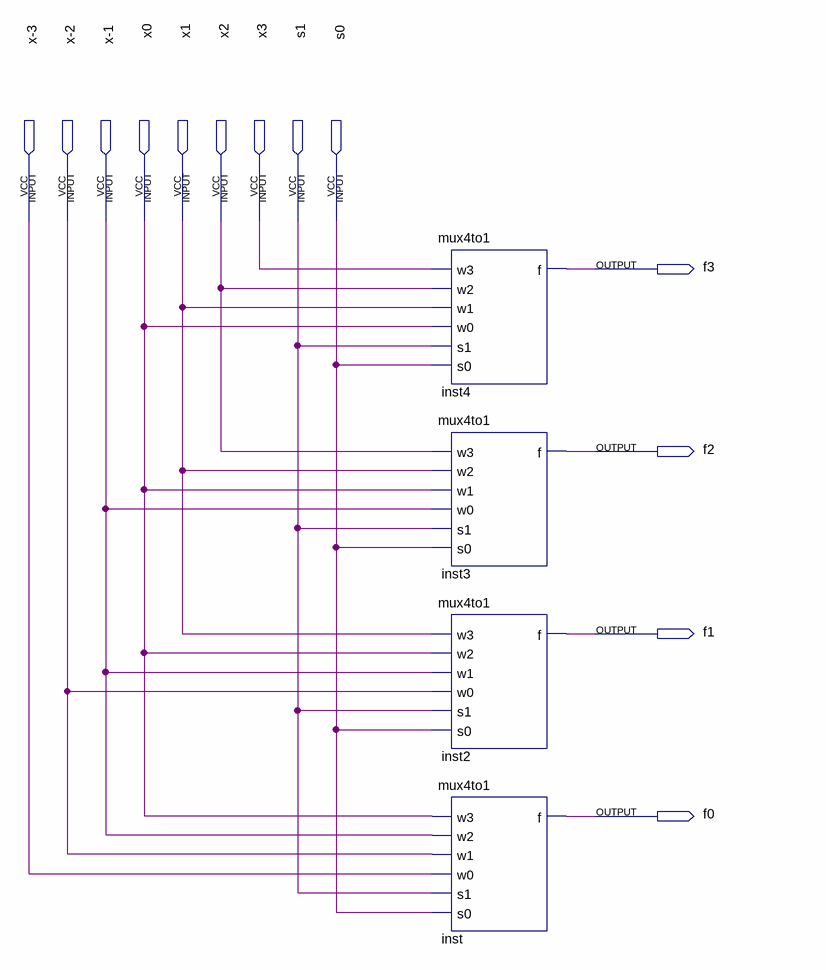
[diagram p0: schematic sheet]
// Quartus schematic lab8step2.bdf as structural Verilog: 4 symbols, 13 pins
module lab8step2 (
  input  \x-3 ,
  input  \x-2 ,
  input  \x-1 ,
  input  x0,
  input  x1,
  input  x2,
  input  x3,
  input  s1,
  input  s0,
  output f3,
  output f2,
  output f1,
  output f0
);

  mux4to1 inst4 (.w3(x3), .w2(x2), .w1(x1), .w0(x0), .s1(s1), .s0(s0), .f(f3));
  mux4to1 inst3 (.w3(x2), .w2(x1), .w1(x0), .w0(\x-1 ), .s1(s1), .s0(s0), .f(f2));
  mux4to1 inst2 (.w3(x1), .w2(x0), .w1(\x-1 ), .w0(\x-2 ), .s1(s1), .s0(s0), .f(f1));
  mux4to1 inst (.w3(x0), .w2(\x-1 ), .w1(\x-2 ), .w0(\x-3 ), .s1(s1), .s0(s0), .f(f0));
endmodule
